# Altium schematic sheet 3_IMU_ETH.SchDoc
size A4; Revision: 1.0; SheetNumber: 3; SheetTotal: 4
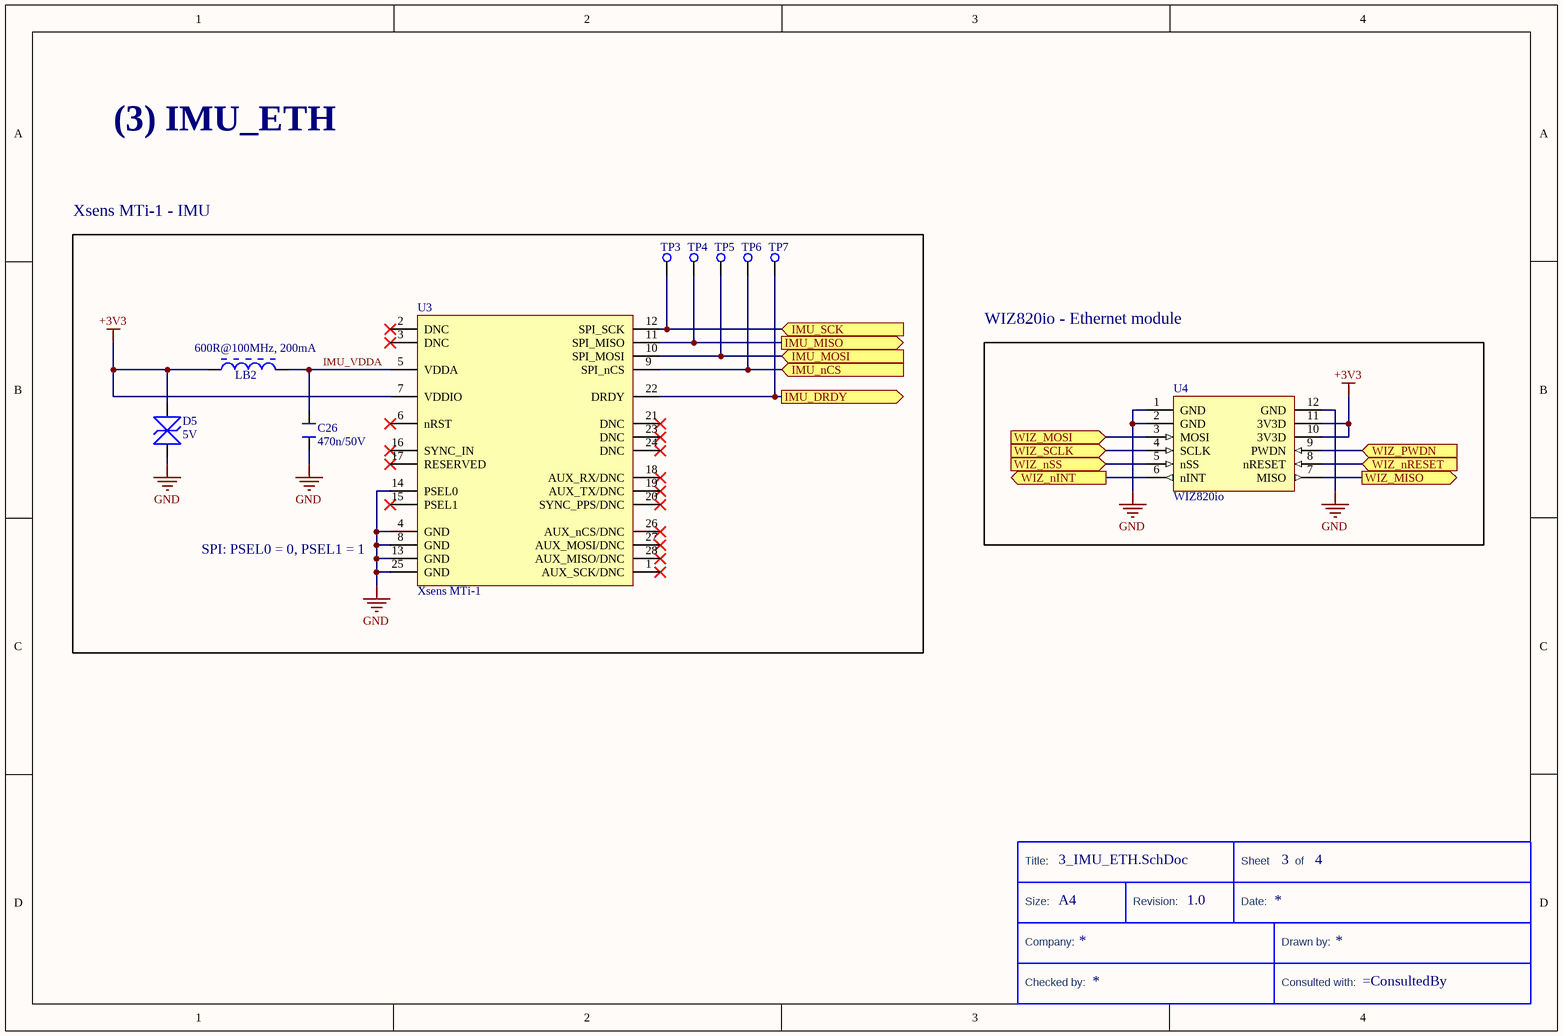
[diagram p0: 3_IMU_ETH.SchDoc]

## Parts
*  Size: A4  (hidden comment: TitleBlock)  (graphical)
C26  470n/50V  [CAP_1206]
D5  5V  [TVS_Littlefuse]
LB2  600R@100MHz, 200mA  [MURA-BLM31A_L]
TP3  TestPoint Pad 1.0mmx1.0mm  [TestPoint Pad 1.0mmx1.0mm]  (value not drawn)
TP4  TestPoint Pad 1.0mmx1.0mm  [TestPoint Pad 1.0mmx1.0mm]  (value not drawn)
TP5  TestPoint Pad 1.0mmx1.0mm  [TestPoint Pad 1.0mmx1.0mm]  (value not drawn)
TP6  TestPoint Pad 1.0mmx1.0mm  [TestPoint Pad 1.0mmx1.0mm]  (value not drawn)
TP7  TestPoint Pad 1.0mmx1.0mm  [TestPoint Pad 1.0mmx1.0mm]  (value not drawn)
U3  Xsens MTi-1  [PLCC-28SMD 1.27MM NINIGI]
U4  WIZ820io  [2x6 Header - 20.32 gap]

## Blocks framed on the sheet
Xsens MTi-1 - IMU: C26 D5 LB2 TP3-TP7 U3
WIZ820io - Ethernet module: U4

## Ports
IMU_DRDY (out), IMU_MISO (out), IMU_MOSI (in), IMU_nCS (in), IMU_SCK (in), WIZ_MISO (out), WIZ_MOSI (in), WIZ_nINT (out), WIZ_nRESET (in), WIZ_nSS (in), WIZ_PWDN (in), WIZ_SCLK (in)

## Nets
+3V3: D5.1 LB2.1 U3.7(VDDIO) U4.10(3V3D) U4.11(3V3D)
GND: C26.1 D5.2 U3.4(GND) U3.8(GND) U3.13(GND) U3.14(PSEL0) U3.25(GND) U4.1(GND) U4.2(GND) U4.12(GND)
IMU_DRDY: TP7.1 U3.22(DRDY) ; port IMU_DRDY
IMU_MISO: TP4.1 U3.11(SPI_MISO) ; port IMU_MISO
IMU_MOSI: TP5.1 U3.10(SPI_MOSI) ; port IMU_MOSI
IMU_nCS: TP6.1 U3.9(SPI_nCS) ; port IMU_nCS
IMU_SCK: TP3.1 U3.12(SPI_SCK) ; port IMU_SCK
IMU_VDDA: C26.2 LB2.2 U3.5(VDDA)
WIZ_MISO: U4.7(MISO) ; port WIZ_MISO
WIZ_MOSI: U4.3(MOSI) ; port WIZ_MOSI
WIZ_nINT: U4.6(nINT) ; port WIZ_nINT
WIZ_nRESET: U4.8(nRESET) ; port WIZ_nRESET
WIZ_nSS: U4.5(nSS) ; port WIZ_nSS
WIZ_PWDN: U4.9(PWDN) ; port WIZ_PWDN
WIZ_SCLK: U4.4(SCLK) ; port WIZ_SCLK

Not connected (* = marked no-connect by the designer): U3 1(AUX_SCK/DNC)* 2(DNC)* 3(DNC)* 6(nRST)* 15(PSEL1)* 16(SYNC_IN)* 17(RESERVED)* 18(AUX_RX/DNC)* 19(AUX_TX/DNC)* 20(SYNC_PPS/DNC)* 21(DNC)* 23(DNC)* 24(DNC)* 26(AUX_nCS/DNC)* 27(AUX_MOSI/DNC)* 28(AUX_MISO/DNC)*

## Notes on the sheet
- (3) IMU_ETH
- (near U3) SPI: PSEL0 = 0, PSEL1 = 1
- (in symbol TitleBlock) Title:; Sheet; of; Size:; Revision:; Date:; Company:; Drawn by:; Checked by:; Consulted with:

## Library data of the parts
* = TitleBlock: Standard Title Block
C26 = CAP_1206: Generic 1206/3216 capacitor
D5 = TVS_5V: TVS Diode TVS_SMAJ5.0CA  5V Bidirectional
LB2 = CMP-2000-05956-1: Chip EMIFIL(R) Inductor Type Chip Ferrite Bead, 600 Ohm, +/- 25%, -55 to 125 degC, 2-Pin SMD (1206), RoHS, Tape and Reel; Manufacturer: Murata; Test Frequency: 100MHz; Unit Weight: 0.000353oz; Brand: MurataElectronics; Impedance: 600Ohms; Maximum DC Resistance: 900mOhms; Package Reference: 1206; Series: BLM; Packaging: Reel; Manufacturer URL: http://www.murata.com/; Mounting Technology: SurfaceMount; Type: ChipFerriteBeadSingleType; RoHS: True; Package / Case: 1206(3216metric); Height: 1.1mm; Product Category: FerriteBeads; Operating Temperature Range: -55Cto+125C; Maximum DC Current: 200mA; Termination Style: SMD/SMT; Tolerance: 25%; Length: 3.2mm; Datasheet URL: https://datasheet.ciiva.com/1014/blm31a-sp-1014542.pdf; Package Description: 2-Pin Surface Mount Device, Body 3.2 x 1.6 mm; Factory Pack Quantity: 3000; Width: 1.6mm; Product: FerriteChipBeads; Datasheet Version: 11/2007
U3 = Xsens MTi-1: PLCC-28SMD socket for Xsens MTi-1 (SPI)
U4 = WIZ820io: 2x6 Famale Header for WIZ820io ETH controller (W5200)